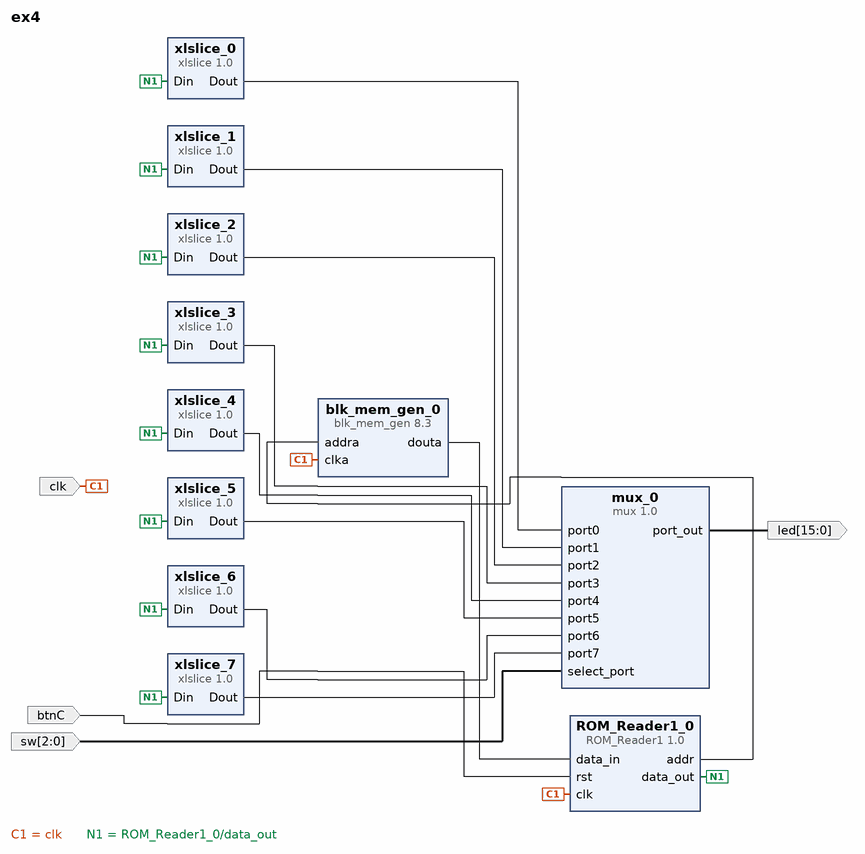
[diagram p0: block diagram of the top level]
# Vivado block design ex4, Vivado 2015.4
create_bd_design ex4

create_bd_port -dir I clk
create_bd_port -dir I btnC
create_bd_port -dir O -from 15 -to 0 led
create_bd_port -dir I -from 2 -to 0 sw

create_bd_cell -type ip -vlnv xilinx.com:ip:xlslice:1.0 xlslice_0
set_property -dict {CONFIG.DOUT_WIDTH 16 CONFIG.DIN_TO 0 CONFIG.DIN_FROM 15 CONFIG.DIN_WIDTH 128} [get_bd_cells xlslice_0]
create_bd_cell -type ip -vlnv xilinx.com:ip:xlslice:1.0 xlslice_1
set_property -dict {CONFIG.DOUT_WIDTH 16 CONFIG.DIN_TO 16 CONFIG.DIN_FROM 31 CONFIG.DIN_WIDTH 128} [get_bd_cells xlslice_1]
create_bd_cell -type ip -vlnv xilinx.com:ip:blk_mem_gen:8.3 blk_mem_gen_0
set_property -dict [list \
  CONFIG.Memory_Type Single_Port_ROM \
  CONFIG.Enable_32bit_Address false \
  CONFIG.Write_Width_A 16 \
  CONFIG.Write_Depth_A 8 \
  CONFIG.Enable_A Always_Enabled \
  CONFIG.Register_PortA_Output_of_Memory_Primitives false \
  CONFIG.Load_Init_File true \
  CONFIG.Coe_File ../../../../../../../Aula08/Projects2016/8words_16bits.coe \
  CONFIG.Use_RSTA_Pin false \
  CONFIG.Port_A_Write_Rate 0 \
  CONFIG.use_bram_block Stand_Alone \
] [get_bd_cells blk_mem_gen_0]
create_bd_cell -type ip -vlnv xilinx.com:ip:xlslice:1.0 xlslice_2
set_property -dict {CONFIG.DOUT_WIDTH 16 CONFIG.DIN_TO 32 CONFIG.DIN_FROM 47 CONFIG.DIN_WIDTH 128} [get_bd_cells xlslice_2]
create_bd_cell -type ip -vlnv xilinx.com:ip:xlslice:1.0 xlslice_3
set_property -dict {CONFIG.DOUT_WIDTH 16 CONFIG.DIN_TO 48 CONFIG.DIN_FROM 63 CONFIG.DIN_WIDTH 128} [get_bd_cells xlslice_3]
create_bd_cell -type ip -vlnv xilinx.com:ip:xlslice:1.0 xlslice_4
set_property -dict {CONFIG.DOUT_WIDTH 16 CONFIG.DIN_TO 64 CONFIG.DIN_FROM 79 CONFIG.DIN_WIDTH 128} [get_bd_cells xlslice_4]
create_bd_cell -type ip -vlnv user.org:user:ROM_Reader1:1.0 ROM_Reader1_0
set_property -dict {CONFIG.data_width 16 CONFIG.address_bits 3} [get_bd_cells ROM_Reader1_0]
create_bd_cell -type ip -vlnv xilinx.com:ip:xlslice:1.0 xlslice_5
set_property -dict {CONFIG.DOUT_WIDTH 16 CONFIG.DIN_TO 80 CONFIG.DIN_FROM 95 CONFIG.DIN_WIDTH 128} [get_bd_cells xlslice_5]
create_bd_cell -type ip -vlnv xilinx.com:ip:xlslice:1.0 xlslice_6
set_property -dict {CONFIG.DOUT_WIDTH 16 CONFIG.DIN_TO 96 CONFIG.DIN_FROM 111 CONFIG.DIN_WIDTH 128} [get_bd_cells xlslice_6]
create_bd_cell -type ip -vlnv xilinx.com:ip:xlslice:1.0 xlslice_7
set_property -dict {CONFIG.DOUT_WIDTH 16 CONFIG.DIN_TO 112 CONFIG.DIN_FROM 127 CONFIG.DIN_WIDTH 128} [get_bd_cells xlslice_7]
create_bd_cell -type ip -vlnv user.org:user:mux:1.0 mux_0

# ---- connections ----

connect_bd_net [get_bd_ports clk] [get_bd_pins blk_mem_gen_0/clka] [get_bd_pins ROM_Reader1_0/clk]
connect_bd_net [get_bd_pins ROM_Reader1_0/data_out] \
  [get_bd_pins xlslice_0/Din] [get_bd_pins xlslice_1/Din] [get_bd_pins xlslice_2/Din] [get_bd_pins xlslice_3/Din] \
  [get_bd_pins xlslice_4/Din] [get_bd_pins xlslice_5/Din] [get_bd_pins xlslice_6/Din] [get_bd_pins xlslice_7/Din]
connect_bd_net [get_bd_ports btnC] [get_bd_pins ROM_Reader1_0/rst]
connect_bd_net [get_bd_pins ROM_Reader1_0/addr] [get_bd_pins blk_mem_gen_0/addra]
connect_bd_net [get_bd_pins blk_mem_gen_0/douta] [get_bd_pins ROM_Reader1_0/data_in]
connect_bd_net [get_bd_pins xlslice_0/Dout] [get_bd_pins mux_0/port0]
connect_bd_net [get_bd_pins xlslice_1/Dout] [get_bd_pins mux_0/port1]
connect_bd_net [get_bd_pins xlslice_2/Dout] [get_bd_pins mux_0/port2]
connect_bd_net [get_bd_pins xlslice_3/Dout] [get_bd_pins mux_0/port3]
connect_bd_net [get_bd_pins xlslice_4/Dout] [get_bd_pins mux_0/port4]
connect_bd_net [get_bd_pins xlslice_5/Dout] [get_bd_pins mux_0/port5]
connect_bd_net [get_bd_pins xlslice_6/Dout] [get_bd_pins mux_0/port6]
connect_bd_net [get_bd_pins xlslice_7/Dout] [get_bd_pins mux_0/port7]
connect_bd_net [get_bd_pins mux_0/port_out] [get_bd_ports led]
connect_bd_net [get_bd_ports sw] [get_bd_pins mux_0/select_port]

validate_bd_design
save_bd_design
